# EAGLE design medium_h223 (EAGLE 5.07)
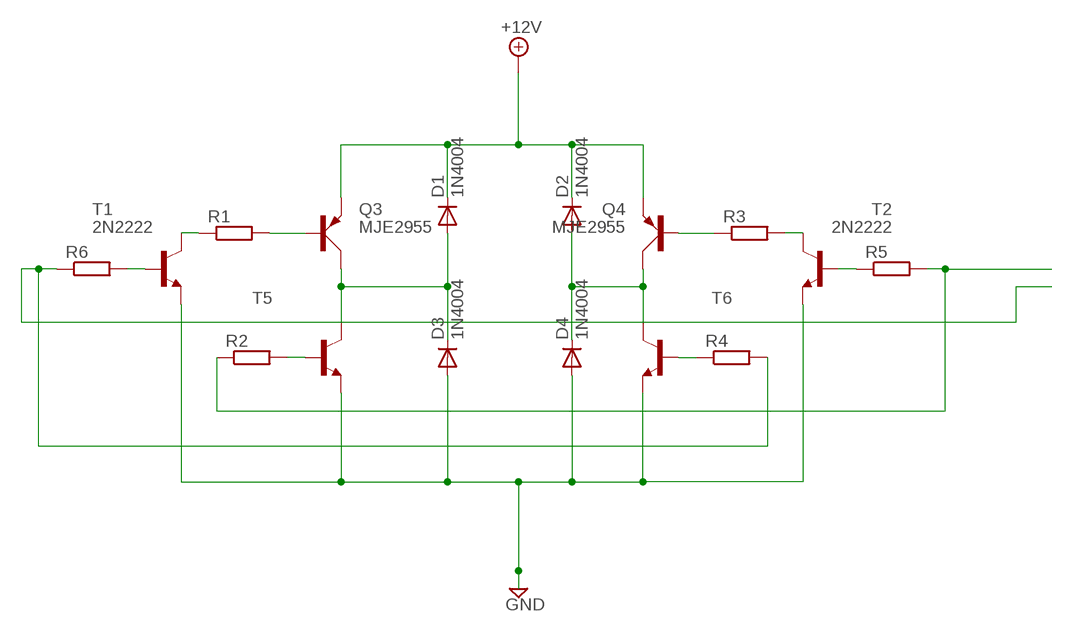
[diagram p0: schematic, sheet 1]

## Parts
D1  1N4004  [DO41-10]
D2  1N4004  [DO41-10]
D3  1N4004  [DO41-10]
D4  1N4004  [DO41-10]
Q3  MJE2955  [TO220AV]
Q4  MJE2955  [TO220AV]
R1  R-EU_0204/7  [0204/7]
R2  R-EU_0204/7  [0204/7]
R3  R-EU_0204/7  [0204/7]
R4  R-EU_0204/7  [0204/7]
R5  R-EU_0204/7  [0204/7]
R6  R-EU_0204/7  [0204/7]
T1  2N2222  [TO18]
T2  2N2222  [TO18]
T5  -NPN-TO220V  [TO220V]
T6  -NPN-TO220V  [TO220V]

## Nets
+12V: D1.C D2.C Q3.E Q4.E
GND: D3.A D4.A T1.1(E) T2.1(E) T5.3(E) T6.3(E)
N$1: R1.1 T1.3(C)
N$2: Q3.B R1.2
N$3: D2.A D4.C Q4.C T6.2(C)
N$4: R4.2 R6.1
N$7: R4.1 T6.1(B)
N$8: Q4.B R3.1
N$9: R2.2 T5.1(B)
N$10: R6.2 T1.2(B)
N$11: R5.1 T2.2(B)
N$12: R3.2 T2.3(C)
N$13: D1.A D3.C Q3.C T5.2(C)
N$15: R2.1 R5.2

## Library data of the parts
D1-D4 = diode:1N4004: DIODE general purpose rectifier, 1 A
Q3 Q4 = transistor-power:MJE2955: PNP TRANSISTOR
R1-R6 = resistor:R-EU_: RESISTOR, European symbol
T1 T2 = transistor:2N2222: NPN TRANSISTOR
T5 T6 = transistor-neu-to92:*-NPN-: NPN Transistror

## Board
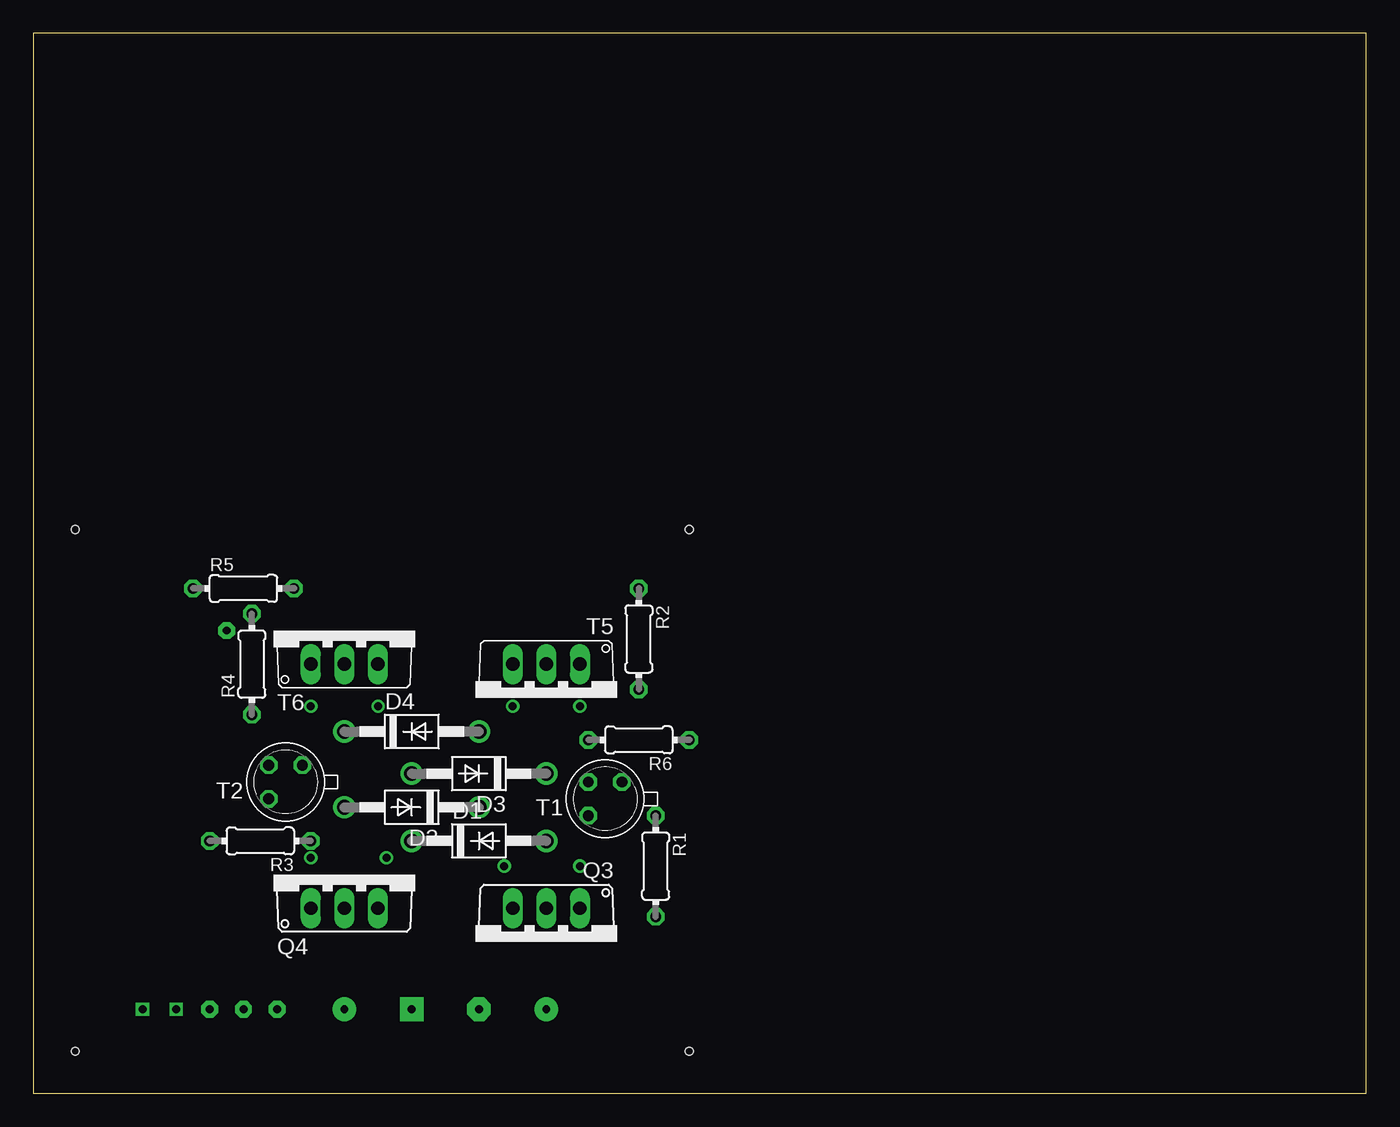
[diagram p1: board, top side]
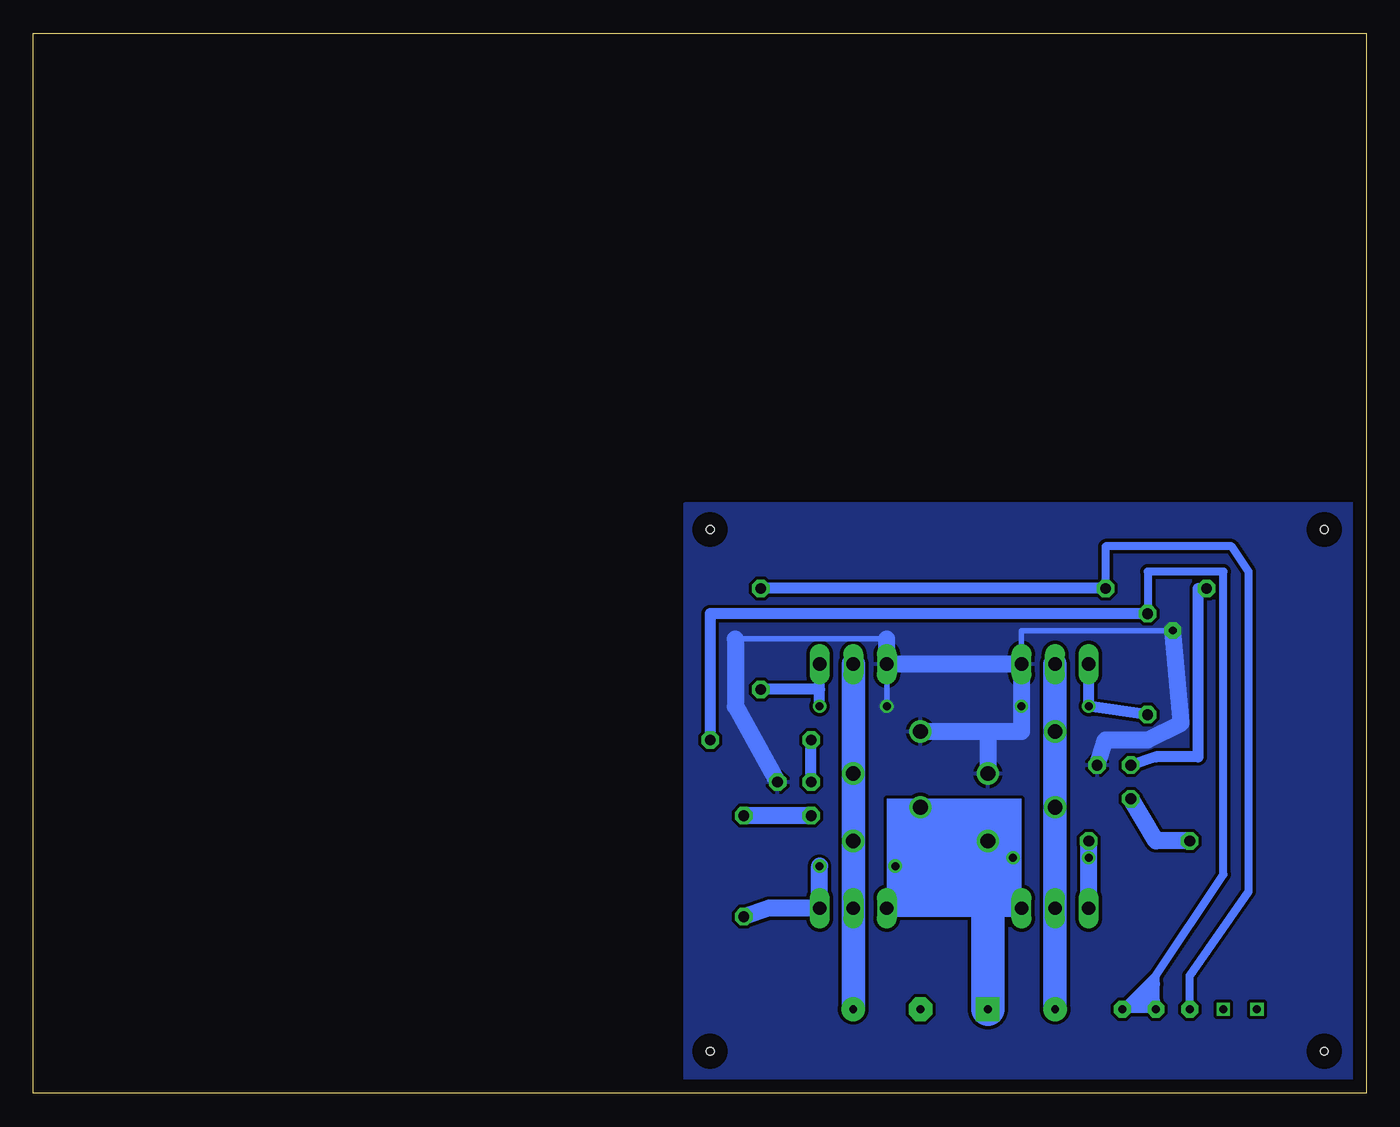
[diagram p2: board, bottom side, seen from below]

Size 100.64 x 80 mm. Coordinates in mm from the lower left corner, seen from the top.
Outline: 0,0 100.64,0 100.64,80 0,80 0,0
Copper layers (1*16): Top 0.035mm / dielectric 1.5mm / Bottom 0.035mm
Design rules "default *": minimum track width 10mil, minimum drill 24mil, track to track 10mil, track to pad 8mil, pad to pad 8mil, via to via 8mil, smd to smd 8mil, copper to edge 40mil, drill to drill 8mil, minimum pad ring 10mil, minimum via ring 8mil, stop-mask expansion 6mil, vias tented up to drill 0mil, thermal gap 10mil
Holes 0.6 mm at 3.17,3.17 49.53,3.17 3.17,42.55 49.53,42.55

### Footprints (pad centres in the part's own frame; a part is rotated, then mirrored left to right if it is on the bottom)
DO41-10 = drill 1.118 round: A 5.08,0; C -5.08,0
TO220AV = drill 1.016 long: B -2.54,-2.54; C 0,-2.54; E 2.54,-2.54
0204/7 = drill 0.813 octagon: 1 -3.81,0; 2 3.81,0
TO18 = drill 0.813 octagon: 1 -1.27,-1.27; 2 1.27,-1.27; 3 1.27,1.27
TO220V = drill 1.016 long: 1 -2.54,-2.54; 2 0,-2.54; 3 2.54,-2.54

### Placement (x,y rotation side)
D1  33.66,19.05 0 top
D2  28.58,21.59 180 top
D3  33.66,24.13 180 top
D4  28.58,27.3 0 top
Q3  38.73,11.43 180 top
Q4  23.5,16.51 0 top
R1  46.99,17.14 270 top
R2  45.72,34.29 270 top
R3  17.15,19.05 180 top
R4  16.51,32.38 90 top
R5  15.88,38.1 0 top
R6  45.72,26.67 180 top
T1  43.18,22.23 180 top
T2  19.05,23.5 180 top
T5  38.73,29.84 180 top
T6  23.5,34.92 0 top

### Tracks (layer width: path | path; a pad name or v marks a point on that pad's centre or on a via)
+12V  (via drill 0.6 pad 1.78)
  Bottom 1.27: 29.85,13.97 Q3.E | Q4.E 28.58,13.97 29.85,13.97 | 29.85,13.97 D1.C D2.C
  Bottom 2.54: v28.58,6.35 28.58,13.97
GND  (via drill 0.6, 0.6 pad 1.27)
  Bottom 0.406: 36.2,34.29 47.62,34.29 | v14.61,34.92 26.04,34.92 T6.3 | T5.3 v36.2,29.21
  Bottom 1.27: 47.62,34.29 47.62,29.21 T1.1 | T2.1 19.69,26.67 16.51,26.67 13.97,27.94 v14.61,34.92 | 36.2,34.29 T5.3 T6.3 v26.04,29.21 26.04,27.3 28.58,27.3 | 28.58,27.3 D4.A | 28.58,27.3 D3.A
  pour Bottom: 0.64,44.45 51.43,44.45 51.43,0.64 0.64,0.64
N$1
  Bottom 1.27: T1.3 R1.1
N$2
  Bottom 1.27: 41.27,17.14 Q3.B 45.09,13.97 R1.2
N$3  (via drill 0.6 pad 1.78)
  Bottom 1.778: D2.A Q4.C v23.5,6.35 | D2.A T6.2 | D2.A D4.C
N$4  (via drill 0.6 pad 1.27)
  Bottom 0.61: 15.88,8.89 v18.42,6.35 17.78,6.35 | 15.88,8.89 10.79,16.51 10.79,39.37 16.51,39.37 R4.2 | 17.78,6.35 v15.88,6.35 15.88,6.99 | 15.88,6.99 15.88,8.26 | 15.88,8.26 16.51,7.62 | 16.51,7.62 17.15,6.99 | 17.78,6.35 17.15,6.99 | 17.15,6.99 16.51,6.99 16.51,7.62 | 15.88,6.99 16.51,7.62 | 15.88,8.26 15.88,8.89
  Bottom 0.813: R6.1 49.53,36.2 R4.2
  other vias: 16.51,36.2
N$5  (via drill 0.6)
  other vias: 10.79,6.35
N$6  (via drill 0.6)
  other vias: 8.26,6.35
N$7
  Bottom 0.813: R4.1 20.96,29.21 T6.1
N$8  (via drill 0.6)
  Bottom 1.27: Q4.B v20.96,17.78 R3.1
N$9
  Bottom 0.813: 41.27,30.48 T5.1 | 41.27,29.21 41.27,30.48 | 41.27,30.48 R2.2
N$10
  Bottom 0.813: T1.2 R6.2
N$11
  Bottom 0.813: T2.2 15.88,25.4 12.7,25.4 12.7,38.1 R5.1
N$12
  Bottom 1.27: T2.3 15.88,19.05 R3.2
N$13  (via drill 0.6 pad 1.78)
  Bottom 1.778: T5.2 D3.C D1.A Q3.C v38.73,6.35
N$14  (via drill 0.6)
  other vias: 20.96,29.21
N$15  (via drill 0.6 pad 1.27)
  Bottom 0.61: R5.2 19.69,41.27 10.16,41.27 8.89,39.37 8.89,15.24 13.33,8.89 v13.33,6.35
  Bottom 0.813: R5.2 R2.1
  other vias: 19.69,38.1
N$16  (via drill 0.6 pad 1.78)
  other vias: 33.66,6.35
N$18  (via drill 0.6)
  other vias: 41.27,29.21
N$19  (via drill 0.6)
  other vias: 26.67,17.78
N$20  (via drill 0.6)
  other vias: 35.56,17.14
N$21  (via drill 0.6)
  other vias: 41.27,17.14
(copper drawn outside any net)
  shapes: Bottom area x1